# Altium project FMC_LOOPBACK.PrjPcb
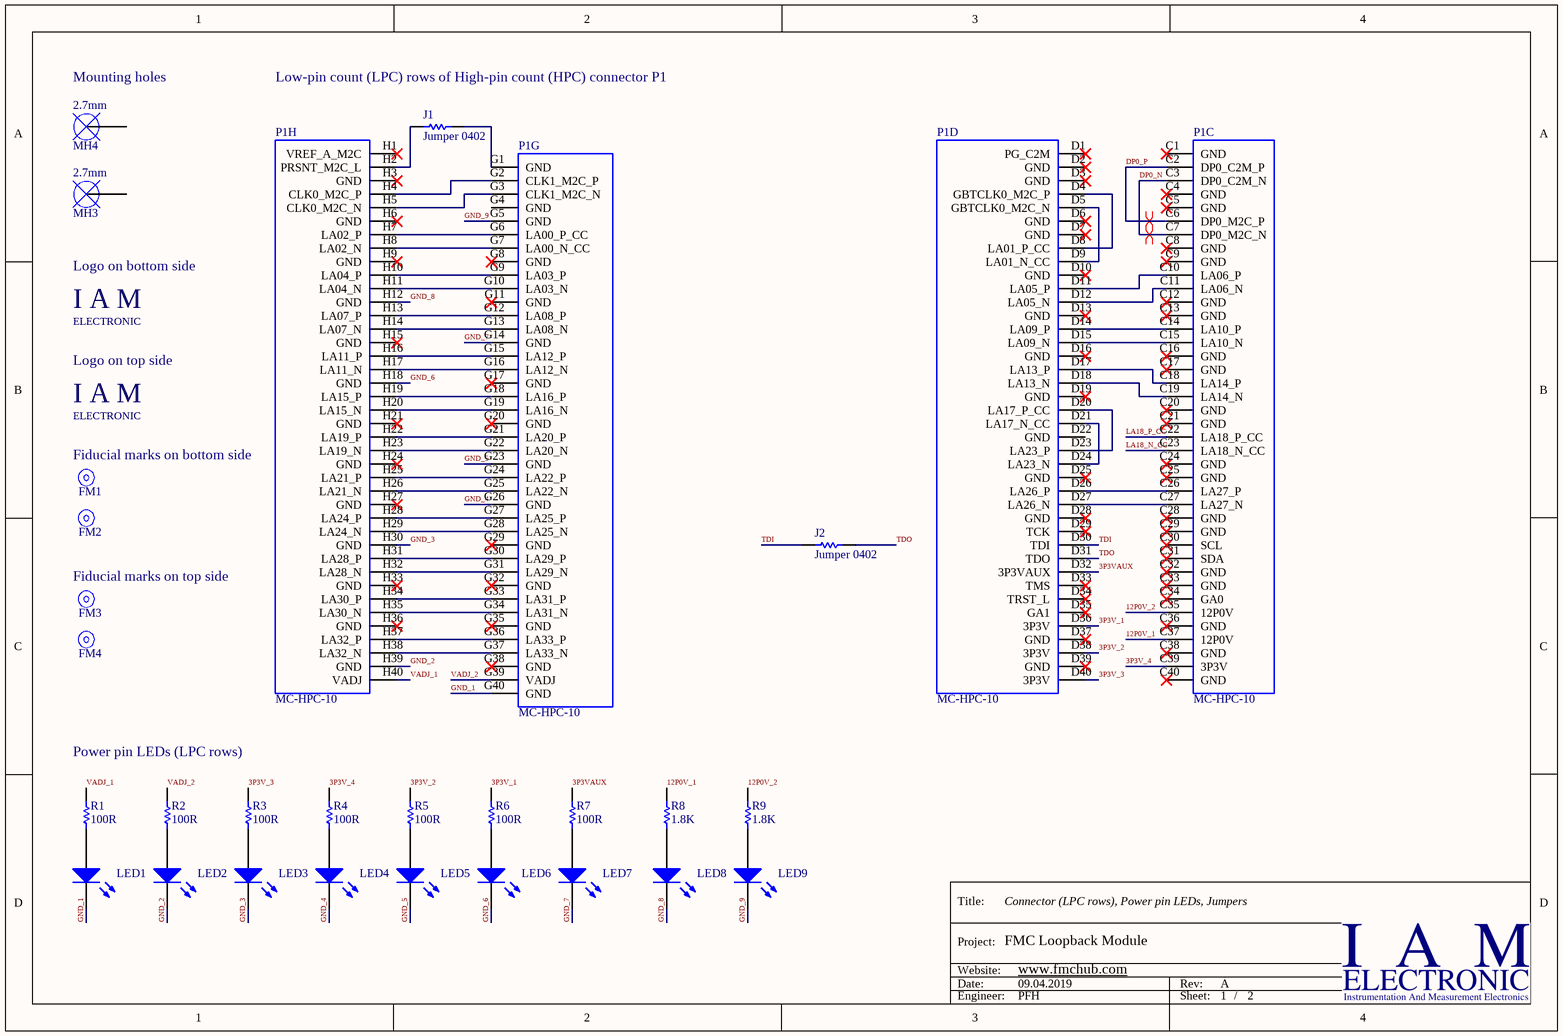
[diagram p0: FMC_LOOPBACK_LPC.SchDoc]
2 sheets, 33 parts. Net scope: global (net labels, ports and power ports of the same name join across sheets).
Board file: FMC_LOOPBACK_REVA.PcbDoc
Sheets:
  FMC_LOOPBACK_LPC.SchDoc
  FMC_LOOPBACK_HPC.SchDoc

## Sheet FMC_LOOPBACK_LPC.SchDoc: Connector (LPC rows), Power pin LEDs, Jumpers
size A4; Date: 09.04.2019; DrawnBy: PFH; Engineer: PFH; DocumentNumber: 1; Revision: A; SheetNumber: 1; SheetTotal: 2; Projekt: FMC Loopback Module; Website: www.fmchub.com; ProjectName: FMC_Loopback

### Parts
FM1  1mm  [FIDUCIAL_MARK_ROUND]  (value not drawn)  (no BOM)
FM2  1mm  [FIDUCIAL_MARK_ROUND]  (value not drawn)  (no BOM)
FM3  1mm  [FIDUCIAL_MARK_ROUND]  (value not drawn)  (no BOM)
FM4  1mm  [FIDUCIAL_MARK_ROUND]  (value not drawn)  (no BOM)
J1  Jumper 0402  [RESC0402(1005)_N]
J2  Jumper 0402  [RESC0402(1005)_N]
LED1  150060GS75000  [0603_A]  (value not drawn)
LED2  150060GS75000  [0603_A]  (value not drawn)
LED3  150060GS75000  [0603_A]  (value not drawn)
LED4  150060GS75000  [0603_A]  (value not drawn)
LED5  150060GS75000  [0603_A]  (value not drawn)
LED6  150060GS75000  [0603_A]  (value not drawn)
LED7  150060GS75000  [0603_A]  (value not drawn)
LED8  150060GS75000  [0603_A]  (value not drawn)
LED9  150060GS75000  [0603_A]  (value not drawn)
MH3  2.7mm  [Mounting_Hole_Plated_2.7mm-COVERED]  (no BOM)
MH4  2.7mm  [Mounting_Hole_Plated_2.7mm-COVERED]  (no BOM)
P1  MC-HPC-10  [ASP-134488-01]  (parts C,D,G,H of 10)
R1  100R  [RESC0603(1608)_L]
R2  100R  [RESC0603(1608)_L]
R3  100R  [RESC0603(1608)_L]
R4  100R  [RESC0603(1608)_L]
R5  100R  [RESC0603(1608)_L]
R6  100R  [RESC0603(1608)_L]
R7  100R  [RESC0603(1608)_L]
R8  1.8K  [RESC1608X55X25LL10T15]
R9  1.8K  [RESC1608X55X25LL10T15]
STR1  IAM LOGO  [IAM LOGO - LARGE - WWW]  (value not drawn)  (no BOM)
STR?  IAM LOGO  [IAM LOGO - MEDIUM - WWW]  (value not drawn)  (no BOM)

### Nets
3P3V_1: P1.D36(3P3V) R6.2
3P3V_2: P1.D38(3P3V) R5.2
3P3V_3: P1.D40(3P3V) R3.2
3P3V_4: P1.C39(3P3V) R4.2
3P3VAUX: P1.D32(3P3VAUX) R7.2
12P0V_1: P1.C37(12P0V) R8.2
12P0V_2: P1.C35(12P0V) R9.2
DP0_N: P1.C3(DP0_C2M_N) P1.C7(DP0_M2C_N)
DP0_P: P1.C2(DP0_C2M_P) P1.C6(DP0_M2C_P)
GND_1: LED1.1(K) P1.G40(GND)
GND_2: LED2.1(K) P1.H39(GND)
GND_3: LED3.1(K) P1.H30(GND)
GND_4: LED4.1(K) P1.G26(GND)
GND_5: LED5.1(K) P1.G23(GND)
GND_6: LED6.1(K) P1.H18(GND)
GND_7: LED7.1(K) P1.G14(GND)
GND_8: LED8.1(K) P1.H12(GND)
GND_9: LED9.1(K) P1.G5(GND)
LA18_N_CC: P1.C23(LA18_N_CC)
LA18_P_CC: P1.C22(LA18_P_CC)
TDI: J2.1 P1.D30(TDI)
TDO: J2.2 P1.D31(TDO)
VADJ_1: P1.H40(VADJ) R1.2
VADJ_2: P1.G39(VADJ) R2.2
NetJ1_1: J1.1 P1.G1(GND)
NetJ1_2: J1.2 P1.H2(PRSNT_M2C_L)
NetLED1_2: LED1.2(A) R1.1
NetLED2_2: LED2.2(A) R2.1
NetLED3_2: LED3.2(A) R3.1
NetLED4_2: LED4.2(A) R4.1
NetLED5_2: LED5.2(A) R5.1
NetLED6_2: LED6.2(A) R6.1
NetLED7_2: LED7.2(A) R7.1
NetLED8_2: LED8.2(A) R8.1
NetLED9_2: LED9.2(A) R9.1
NetP1_C10: P1.C10(LA06_P) P1.D11(LA05_P)
NetP1_C11: P1.C11(LA06_N) P1.D12(LA05_N)
NetP1_C14: P1.C14(LA10_P) P1.D14(LA09_P)
NetP1_C15: P1.C15(LA10_N) P1.D15(LA09_N)
NetP1_C18: P1.C18(LA14_P) P1.D17(LA13_P)
NetP1_C19: P1.C19(LA14_N) P1.D18(LA13_N)
NetP1_C26: P1.C26(LA27_P) P1.D26(LA26_P)
NetP1_C27: P1.C27(LA27_N) P1.D27(LA26_N)
NetP1_D4: P1.D4(GBTCLK0_M2C_P) P1.D8(LA01_P_CC)
NetP1_D5: P1.D5(GBTCLK0_M2C_N) P1.D9(LA01_N_CC)
NetP1_D20: P1.D20(LA17_P_CC) P1.D23(LA23_P)
NetP1_D21: P1.D21(LA17_N_CC) P1.D24(LA23_N)
NetP1_G2: P1.G2(CLK1_M2C_P) P1.H4(CLK0_M2C_P)
NetP1_G3: P1.G3(CLK1_M2C_N) P1.H5(CLK0_M2C_N)
NetP1_G6: P1.G6(LA00_P_CC) P1.H7(LA02_P)
NetP1_G7: P1.G7(LA00_N_CC) P1.H8(LA02_N)
NetP1_G9: P1.G9(LA03_P) P1.H10(LA04_P)
NetP1_G10: P1.G10(LA03_N) P1.H11(LA04_N)
NetP1_G12: P1.G12(LA08_P) P1.H13(LA07_P)
NetP1_G13: P1.G13(LA08_N) P1.H14(LA07_N)
NetP1_G15: P1.G15(LA12_P) P1.H16(LA11_P)
NetP1_G16: P1.G16(LA12_N) P1.H17(LA11_N)
NetP1_G18: P1.G18(LA16_P) P1.H19(LA15_P)
NetP1_G19: P1.G19(LA16_N) P1.H20(LA15_N)
NetP1_G21: P1.G21(LA20_P) P1.H22(LA19_P)
NetP1_G22: P1.G22(LA20_N) P1.H23(LA19_N)
NetP1_G24: P1.G24(LA22_P) P1.H25(LA21_P)
NetP1_G25: P1.G25(LA22_N) P1.H26(LA21_N)
NetP1_G27: P1.G27(LA25_P) P1.H28(LA24_P)
NetP1_G28: P1.G28(LA25_N) P1.H29(LA24_N)
NetP1_G30: P1.G30(LA29_P) P1.H31(LA28_P)
NetP1_G31: P1.G31(LA29_N) P1.H32(LA28_N)
NetP1_G33: P1.G33(LA31_P) P1.H34(LA30_P)
NetP1_G34: P1.G34(LA31_N) P1.H35(LA30_N)
NetP1_G36: P1.G36(LA33_P) P1.H37(LA32_P)
NetP1_G37: P1.G37(LA33_N) P1.H38(LA32_N)

Not connected (* = marked no-connect by the designer): FM1 FD0; FM2 FD0; FM3 FD0; FM4 FD0; MH3 0; MH4 0; P1 C1(GND)* C4(GND)* C5(GND)* C8(GND)* C9(GND)* C12(GND)* C13(GND)* C16(GND)* C17(GND)* C20(GND)* C21(GND)* C24(GND)* C25(GND)* C28(GND)* C29(GND)* C30(SCL)* C31(SDA)* C32(GND)* C33(GND)* C34(GA0)* C36(GND)* C38(GND)* C40(GND)* D1(PG_C2M)* D2(GND)* D3(GND)* D6(GND)* D7(GND)* D10(GND)* D13(GND)* D16(GND)* D19(GND)* D22(GND) D25(GND)* D28(GND)* D29(TCK)* D33(TMS)* D34(TRST_L)* D35(GA1)* D37(GND)* D39(GND)* G4(GND) G8(GND)* G11(GND)* G17(GND)* G20(GND)* G29(GND)* G32(GND)* G35(GND)* G38(GND)* H1(VREF_A_M2C)* H3(GND)* H6(GND)* H9(GND)* H15(GND)* H21(GND)* H24(GND)* H27(GND)* H33(GND)* H36(GND)*

### Layout directives
differential pair: DP0_N, DP0_P

### Notes on the sheet
- (near MH4) Mounting holes
- (near J1) Low-pin count (LPC) rows of High-pin count (HPC) connector P1
- (near STR1) Logo on bottom side
- (near STR?) Logo on top side
- (near FM1) Fiducial marks on bottom side
- (near FM3) Fiducial marks on top side
- Power pin LEDs (LPC rows)
- Title:
- Project:
- Date:
- Website:
- Rev:
- Engineer:
- Sheet:
- /
- (in symbol IAM_LOGO) I A M; ELECTRONIC

### Library data of the parts
FM1-FM4 = Fiducial_Mark: Fiducial mark, width 1mm, clearance 3mm; Width: 1 mm; Clearance: 3 mm
J1 J2 = CMP-1011-00001-1: Jumper 0402 (1005 Metric); Tolerance: None; Case-Metric: 1005; Case-EIA: 0402; Value: 0.00 Ohm; Power: None; Technology: SMT
LED1-LED9 = CMP-1426-00002-1: SMD mono-color Chip LED, WL-SMCW, Green; Manufacturer: Wuerth Elektronik; ComponentLink1URL: http://www.we-online.com; ComponentLink2Description: Datasheet; Color: Green; ComponentLink2URL: http://katalog.we-online.com/led/datasheet/150060GS75000.pdf; PartNumber: 150060GS75000; PackageReference: 0603_A; ComponentLink1Description: Manufacturer URL; Part: 150060GS75000
MH3 MH4 = Mounting_Hole_2.7mm: Mounting hole, hole size 2.7mm; Hole radius: 2.7 mm; Diameter (plated): *; Keep out (radius): *; Plated: *
P1 = MC-HPC-10: MC-HPC-10, FMC High-pin count connector, lead free, 400 I/Os, male, 10 mm mated stack height; Manufacturer: Samtec; Manufacturer Ref: SEAM-40-03.5-S-10-2-A-K-TR-VITA57.0; Pitch: 1.27 mm; Mated Stack Height: 10 mm; Solder Type: Lead-Free; Number I/O: 400; PartName: ASP-134488-01; Part: ASP-134488-01; Vita PartNumber: MC-HPC-10; Pin Count: High; Gender: male; Supplier 1: Digi-Key; Supplier Part Number 1: SAM8730-ND
R1-R7 = CMP-1012-00050-1: 100R 0.1W 5% 0603 (1608 Metric)  SMD; Part: ERJ-3GEYJ101V; Manufacturer: Panasonic; Case-EIA: 0603; Value: 100.00 Ohm; Case-Metric: 1608; Tolerance: 5 %; Technology: SMT; Power: 0.1 W
R8 R9 = CMP-2000-06931-1: 1K8 0.1W 5% 0603 (1608 Metric)  SMD; Manufacturer: Yageo; Part: RC0603JR-071K8L; Voltage Rating: 50V; Resistance: 1.8kohm; Resistor Case Style: 0603[1608Metric]; Power Rating: 100mW; Resistance Tolerance: ±1%; Temperature Coefficient: ±100ppm/°C; Product Range: RCSeries; Resistor Element Type: ThickFilm; SVHC: ToBeAdvised; Mounting Technology: SurfaceMount; Datasheet URL: http://www.yageo.com/documents/recent/PYu-RC_Group_51_RoHS_L_7.pdf; Package Reference: 0603; Package Description: 2-Pin Surface Mount Device, Body 1.6 x 0.8 mm; MSL: MSL1-Unlimited; Manufacturer URL: http://www.yageo.com/; Packaging: CutTape; Datasheet Version: Rev. 7, 05/2017; Automotive Qualification Standard: -
STR1 STR? = IAM_LOGO: I A M E L E C T R O N I C - Logo; Layer: Top Overlay; Manufacturer: IAM ELECTRONIC; Part: Logo

## Sheet FMC_LOOPBACK_HPC.SchDoc: Connector (HPC rows), Power pin LEDs
size A4; Date: 09.04.2019; DrawnBy: PFH; Engineer: PFH; DocumentNumber: 1; Revision: A; SheetNumber: 2; SheetTotal: 2; Projekt: FMC Loopback Module; Website: www.fmchub.com; ProjectName: FMC_Loopback
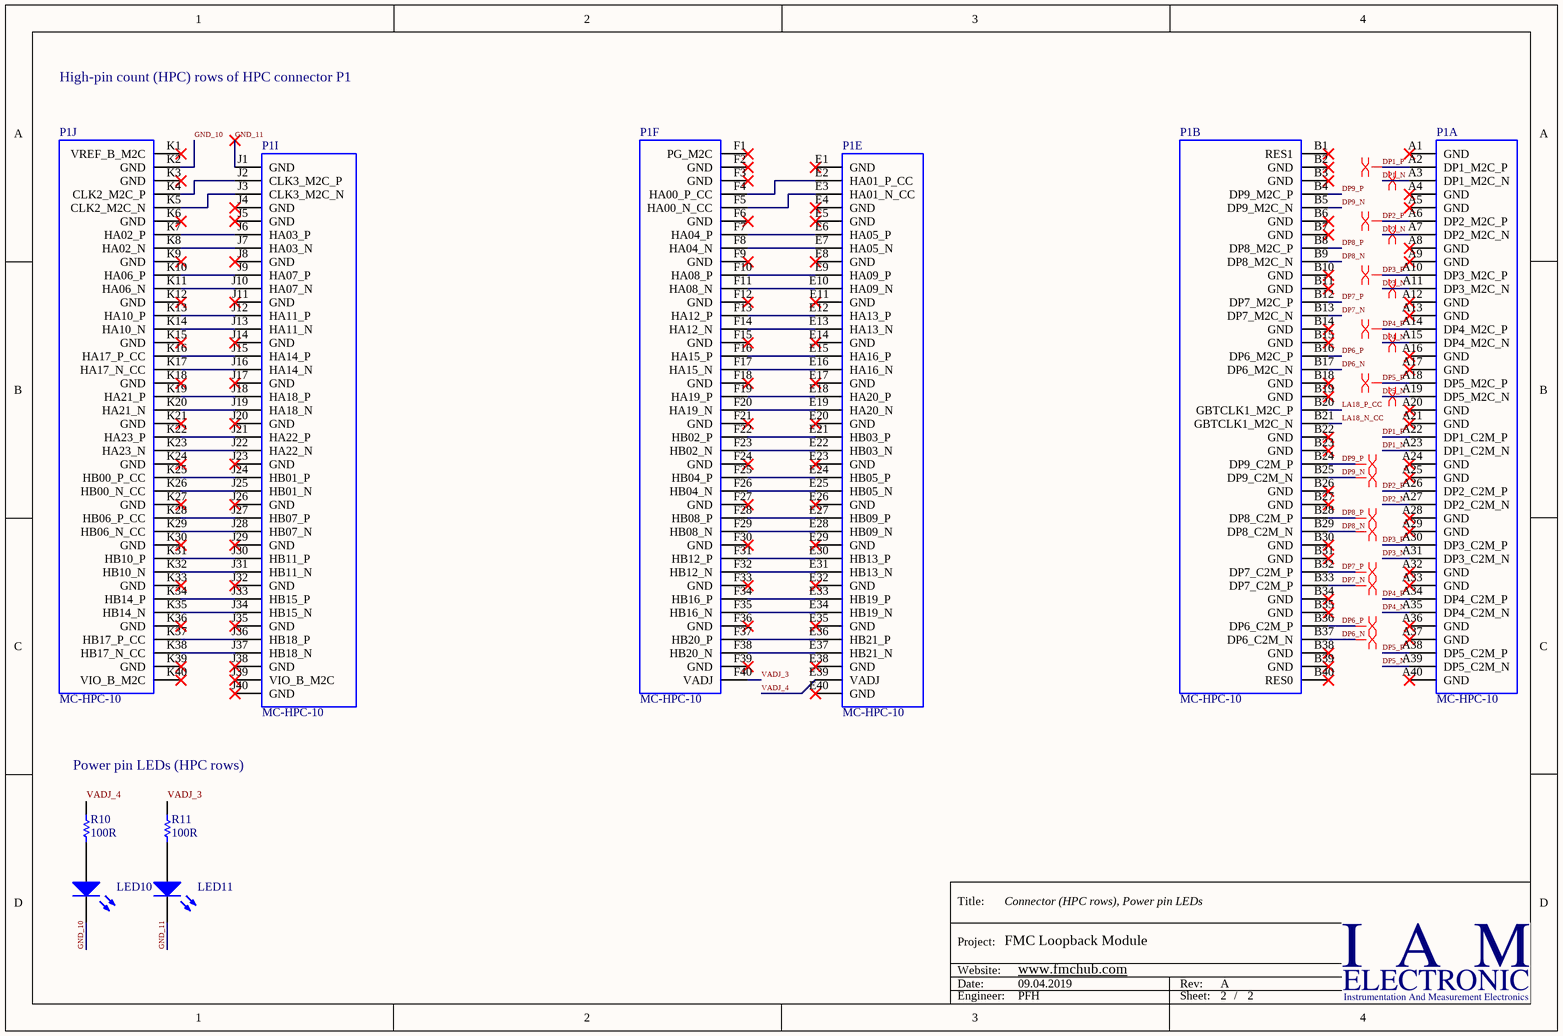
[diagram p1: FMC_LOOPBACK_HPC.SchDoc]

### Parts
LED10  150060GS75000  [0603_A]  (value not drawn)
LED11  150060GS75000  [0603_A]  (value not drawn)
P1  MC-HPC-10  [ASP-134488-01]  (parts A,B,E,F,I,J of 10)
R10  100R  [RESC0603(1608)_L]
R11  100R  [RESC0603(1608)_L]

### Nets
DP1_N: P1.A3(DP1_M2C_N) P1.A23(DP1_C2M_N)
DP1_P: P1.A2(DP1_M2C_P) P1.A22(DP1_C2M_P)
DP2_N: P1.A7(DP2_M2C_N) P1.A27(DP2_C2M_N)
DP2_P: P1.A6(DP2_M2C_P) P1.A26(DP2_C2M_P)
DP3_N: P1.A11(DP3_M2C_N) P1.A31(DP3_C2M_N)
DP3_P: P1.A10(DP3_M2C_P) P1.A30(DP3_C2M_P)
DP4_N: P1.A15(DP4_M2C_N) P1.A35(DP4_C2M_N)
DP4_P: P1.A14(DP4_M2C_P) P1.A34(DP4_C2M_P)
DP5_N: P1.A19(DP5_M2C_N) P1.A39(DP5_C2M_N)
DP5_P: P1.A18(DP5_M2C_P) P1.A38(DP5_C2M_P)
DP6_N: P1.B17(DP6_M2C_N) P1.B37(DP6_C2M_N)
DP6_P: P1.B16(DP6_M2C_P) P1.B36(DP6_C2M_P)
DP7_N: P1.B13(DP7_M2C_N) P1.B33(DP7_C2M_P)
DP7_P: P1.B12(DP7_M2C_P) P1.B32(DP7_C2M_P)
DP8_N: P1.B9(DP8_M2C_N) P1.B29(DP8_C2M_N)
DP8_P: P1.B8(DP8_M2C_P) P1.B28(DP8_C2M_P)
DP9_N: P1.B5(DP9_M2C_N) P1.B25(DP9_C2M_N)
DP9_P: P1.B4(DP9_M2C_P) P1.B24(DP9_C2M_P)
GND_10: LED10.1(K) P1.K2(GND)
GND_11: LED11.1(K) P1.J1(GND)
LA18_N_CC: P1.B21(GBTCLK1_M2C_N)
LA18_P_CC: P1.B20(GBTCLK1_M2C_P)
VADJ_3: P1.F40(VADJ) R11.2
VADJ_4: P1.E39(VADJ) R10.2
NetLED10_2: LED10.2(A) R10.1
NetLED11_2: LED11.2(A) R11.1
NetP1_E2: P1.E2(HA01_P_CC) P1.F4(HA00_P_CC)
NetP1_E3: P1.E3(HA01_N_CC) P1.F5(HA00_N_CC)
NetP1_E6: P1.E6(HA05_P) P1.F7(HA04_P)
NetP1_E7: P1.E7(HA05_N) P1.F8(HA04_N)
NetP1_E9: P1.E9(HA09_P) P1.F10(HA08_P)
NetP1_E10: P1.E10(HA09_N) P1.F11(HA08_N)
NetP1_E12: P1.E12(HA13_P) P1.F13(HA12_P)
NetP1_E13: P1.E13(HA13_N) P1.F14(HA12_N)
NetP1_E15: P1.E15(HA16_P) P1.F16(HA15_P)
NetP1_E16: P1.E16(HA16_N) P1.F17(HA15_N)
NetP1_E18: P1.E18(HA20_P) P1.F19(HA19_P)
NetP1_E19: P1.E19(HA20_N) P1.F20(HA19_N)
NetP1_E21: P1.E21(HB03_P) P1.F22(HB02_P)
NetP1_E22: P1.E22(HB03_N) P1.F23(HB02_N)
NetP1_E24: P1.E24(HB05_P) P1.F25(HB04_P)
NetP1_E25: P1.E25(HB05_N) P1.F26(HB04_N)
NetP1_E27: P1.E27(HB09_P) P1.F28(HB08_P)
NetP1_E28: P1.E28(HB09_N) P1.F29(HB08_N)
NetP1_E30: P1.E30(HB13_P) P1.F31(HB12_P)
NetP1_E31: P1.E31(HB13_N) P1.F32(HB12_N)
NetP1_E33: P1.E33(HB19_P) P1.F34(HB16_P)
NetP1_E34: P1.E34(HB19_N) P1.F35(HB16_N)
NetP1_E36: P1.E36(HB21_P) P1.F37(HB20_P)
NetP1_E37: P1.E37(HB21_N) P1.F38(HB20_N)
NetP1_J2: P1.J2(CLK3_M2C_P) P1.K4(CLK2_M2C_P)
NetP1_J3: P1.J3(CLK3_M2C_N) P1.K5(CLK2_M2C_N)
NetP1_J6: P1.J6(HA03_P) P1.K7(HA02_P)
NetP1_J7: P1.J7(HA03_N) P1.K8(HA02_N)
NetP1_J9: P1.J9(HA07_P) P1.K10(HA06_P)
NetP1_J10: P1.J10(HA07_N) P1.K11(HA06_N)
NetP1_J12: P1.J12(HA11_P) P1.K13(HA10_P)
NetP1_J13: P1.J13(HA11_N) P1.K14(HA10_N)
NetP1_J15: P1.J15(HA14_P) P1.K16(HA17_P_CC)
NetP1_J16: P1.J16(HA14_N) P1.K17(HA17_N_CC)
NetP1_J18: P1.J18(HA18_P) P1.K19(HA21_P)
NetP1_J19: P1.J19(HA18_N) P1.K20(HA21_N)
NetP1_J21: P1.J21(HA22_P) P1.K22(HA23_P)
NetP1_J22: P1.J22(HA22_N) P1.K23(HA23_N)
NetP1_J24: P1.J24(HB01_P) P1.K25(HB00_P_CC)
NetP1_J25: P1.J25(HB01_N) P1.K26(HB00_N_CC)
NetP1_J27: P1.J27(HB07_P) P1.K28(HB06_P_CC)
NetP1_J28: P1.J28(HB07_N) P1.K29(HB06_N_CC)
NetP1_J30: P1.J30(HB11_P) P1.K31(HB10_P)
NetP1_J31: P1.J31(HB11_N) P1.K32(HB10_N)
NetP1_J33: P1.J33(HB15_P) P1.K34(HB14_P)
NetP1_J34: P1.J34(HB15_N) P1.K35(HB14_N)
NetP1_J36: P1.J36(HB18_P) P1.K37(HB17_P_CC)
NetP1_J37: P1.J37(HB18_N) P1.K38(HB17_N_CC)

Not connected (* = marked no-connect by the designer): P1 A1(GND)* A4(GND)* A5(GND)* A8(GND)* A9(GND)* A12(GND)* A13(GND)* A16(GND)* A17(GND)* A20(GND)* A21(GND)* A24(GND)* A25(GND)* A28(GND)* A29(GND)* A32(GND)* A33(GND)* A36(GND)* A37(GND)* A40(GND)* B1(RES1)* B2(GND)* B3(GND)* B6(GND)* B7(GND)* B10(GND)* B11(GND)* B14(GND)* B15(GND)* B18(GND)* B19(GND)* B22(GND)* B23(GND)* B26(GND)* B27(GND)* B30(GND)* B31(GND)* B34(GND)* B35(GND)* B38(GND)* B39(GND)* B40(RES0)* E1(GND)* E4(GND)* E5(GND)* E8(GND)* E11(GND)* E14(GND)* E17(GND)* E20(GND)* E23(GND)* E26(GND)* E29(GND)* E32(GND)* E35(GND)* E38(GND)* E40(GND)* F1(PG_M2C)* F2(GND)* F3(GND)* F6(GND)* F9(GND)* F12(GND)* F15(GND)* F18(GND)* F21(GND)* F24(GND)* F27(GND)* F30(GND)* F33(GND)* F36(GND)* F39(GND)* J4(GND)* J5(GND)* J8(GND)* J11(GND)* J14(GND)* J17(GND)* J20(GND)* J23(GND)* J26(GND)* J29(GND)* J32(GND)* J35(GND)* J38(GND)* J39(VIO_B_M2C)* J40(GND)* K1(VREF_B_M2C)* K3(GND)* K6(GND)* K9(GND)* K12(GND)* K15(GND)* K18(GND)* K21(GND)* K24(GND)* K27(GND)* K30(GND)* K33(GND)* K36(GND)* K39(GND)* K40(VIO_B_M2C)*

### Layout directives
differential pair: DP1_N, DP1_P, DP2_N, DP2_P, DP3_N, DP3_P, DP4_N, DP4_P, DP5_N, DP5_P, DP6_N, DP6_P, DP7_N, DP7_P, DP8_N, DP8_P, DP9_N, DP9_P

### Notes on the sheet
- High-pin count (HPC) rows of HPC connector P1
- Power pin LEDs (HPC rows)
- Title:
- Project:
- Date:
- Website:
- Rev:
- Engineer:
- Sheet:
- /

### Library data of the parts
LED10 LED11 = CMP-1426-00002-1: as LED1 on sheet FMC_LOOPBACK_LPC; ComponentLink1URL: http://www.we-online.com; ComponentLink2Description: Datasheet; Color: Green; ComponentLink2URL: http://katalog.we-online.com/led/datasheet/150060GS75000.pdf; PartNumber: 150060GS75000; PackageReference: 0603_A; ComponentLink1Description: Manufacturer URL; Part: 150060GS75000
P1 = MC-HPC-10: as P1 on sheet FMC_LOOPBACK_LPC; PartName: ASP-134488-01; Part: ASP-134488-01; Vita PartNumber: MC-HPC-10; Pin Count: High; Gender: male; Supplier 1: Digi-Key; Supplier Part Number 1: SAM8730-ND
R10 R11 = CMP-1012-00050-1: as R1 on sheet FMC_LOOPBACK_LPC; Tolerance: 5 %; Technology: SMT; Power: 0.1 W

## Nets that join several sheets
LA18_N_CC: FMC_LOOPBACK_LPC (P1.C23), FMC_LOOPBACK_HPC (P1.B21)
LA18_P_CC: FMC_LOOPBACK_LPC (P1.C22), FMC_LOOPBACK_HPC (P1.B20)

## Assembly variants
Jumper not installed: not fitted J1 J2